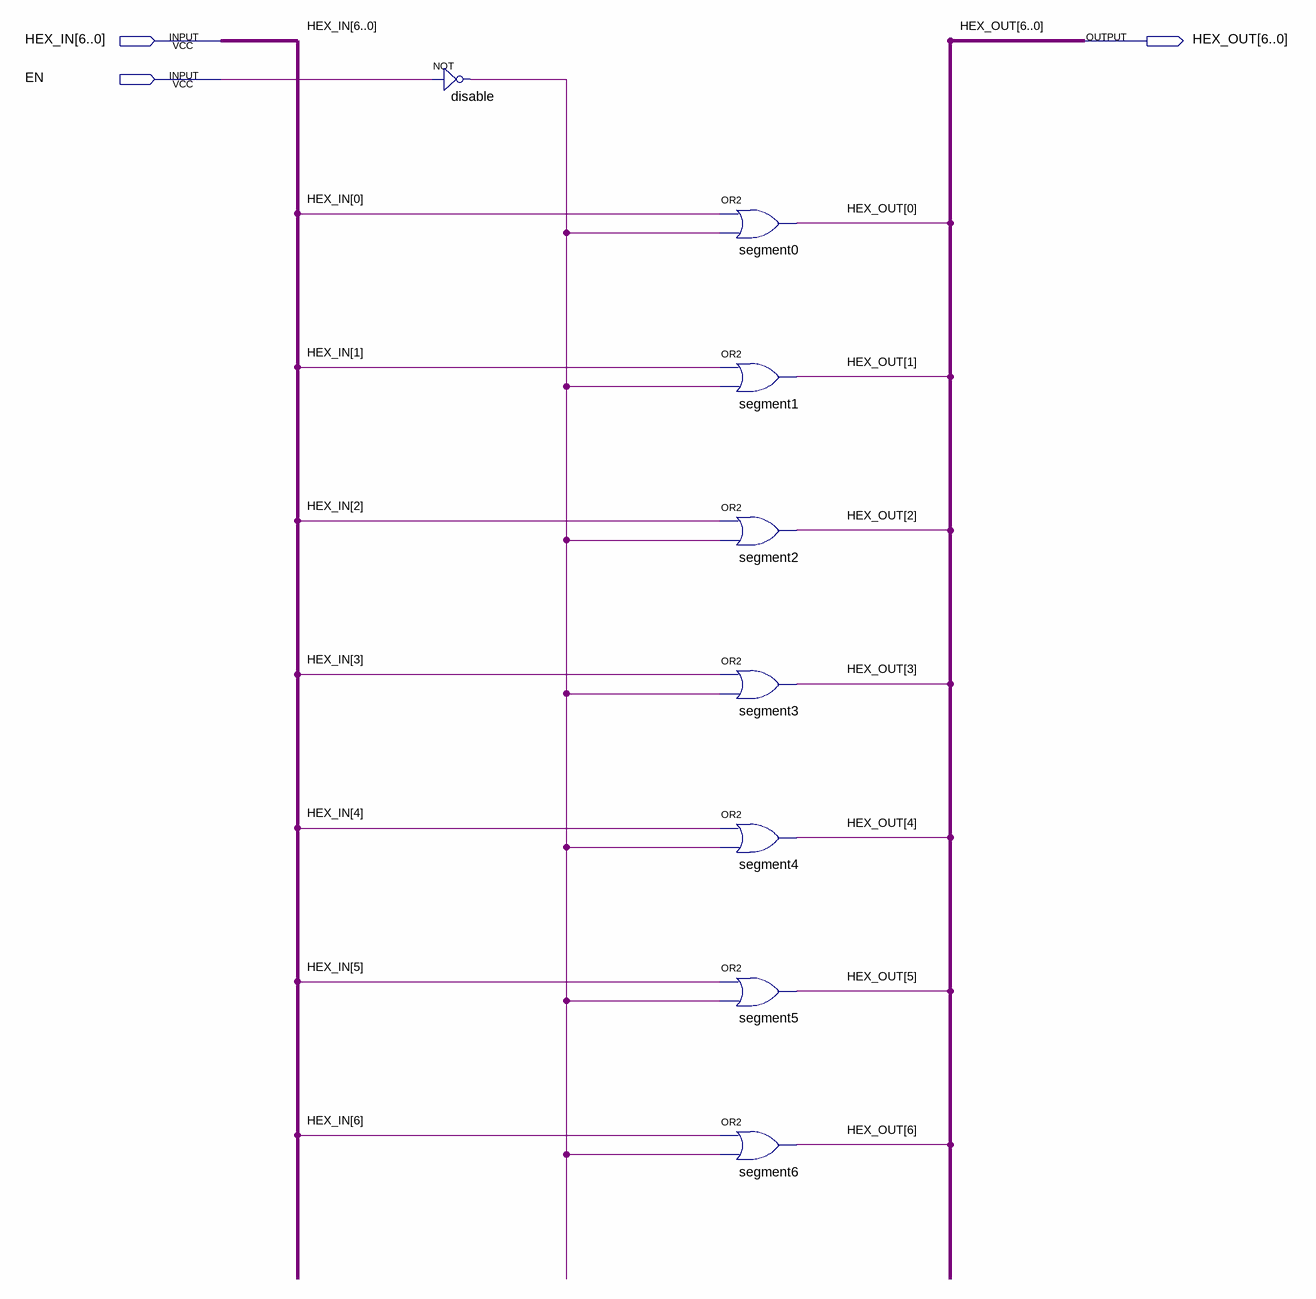
[diagram p0: schematic sheet]
// Quartus schematic ENABLE7.bdf as structural Verilog: 8 symbols, 3 pins
module ENABLE7 (
  input  [6:0] HEX_IN,
  input  EN,
  output [6:0] HEX_OUT
);

  wire disable_out;

  not \disable  (disable_out, EN);
  or segment0 (HEX_OUT[0], HEX_IN[0], disable_out);
  or segment1 (HEX_OUT[1], HEX_IN[1], disable_out);
  or segment2 (HEX_OUT[2], HEX_IN[2], disable_out);
  or segment3 (HEX_OUT[3], HEX_IN[3], disable_out);
  or segment4 (HEX_OUT[4], HEX_IN[4], disable_out);
  or segment5 (HEX_OUT[5], HEX_IN[5], disable_out);
  or segment6 (HEX_OUT[6], HEX_IN[6], disable_out);
endmodule
